# EAGLE schematic XT-009_Gold Standard (EAGLE 9.5.1)
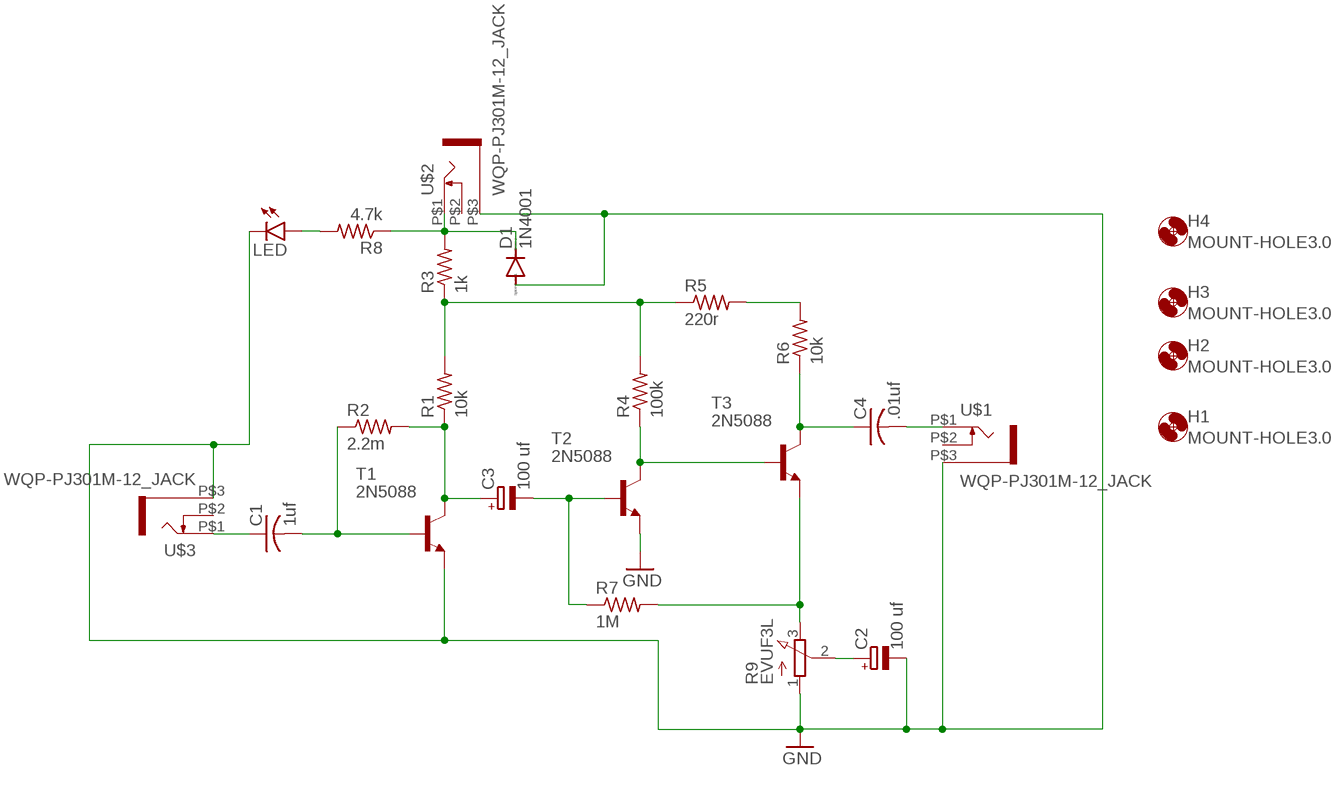
[diagram p0: schematic, sheet 1]

## Parts
C1  1uf  C-US050-025X075  [C050-025X075]
C2  100 uf  CPOL-EUE2.5-7  [E2,5-7]
C3  100 uf  CPOL-EUE2.5-7  [E2,5-7]
C4  .01uf  C-US050-025X075  [C050-025X075]
D1  1N4001  1N4004  [DO41-10]
H1  MOUNT-HOLE3.0  [3,0]
H2  MOUNT-HOLE3.0  [3,0]
H3  MOUNT-HOLE3.0  [3,0]
H4  MOUNT-HOLE3.0  [3,0]
LED  LED3MM  [LED3MM]
R1  10k  R-US_0207/7  [0207/7]
R2  2.2m  R-US_0207/7  [0207/7]
R3  1k  R-US_0207/7  [0207/7]
R4  100k  R-US_0207/7  [0207/7]
R5  220r  R-US_0207/7  [0207/7]
R6  10k  R-US_0207/7  [0207/7]
R7  1M  R-US_0207/7  [0207/7]
R8  4.7k  R-US_0207/7  [0207/7]
R9  EVUF3L  [EVUFXL]
T1  2N5088  [TO92]
T2  2N5088  [TO92]
T3  2N5088  [TO92]
U$1  WQP-PJ301M-12_JACK  [WQP-PJ301M-12_JACK]
U$2  WQP-PJ301M-12_JACK  [WQP-PJ301M-12_JACK]
U$3  WQP-PJ301M-12_JACK  [WQP-PJ301M-12_JACK]

## Nets
GND: C2.- D1.A LED.K(C) R9.1(A) T1.3(E) T2.3(E) U$1.P$3 U$2.P$3 U$3.P$3
N$1: C1.2 R2.1 T1.2(B)
N$2: C3.+ R1.1 R2.2 T1.1(C)
N$3: R1.2 R3.1 R4.2 R5.1
N$4: C1.1 U$3.P$1
N$5: LED.A R8.2
N$6: C3.- R7.1 T2.2(B)
N$7: R4.1 T2.1(C) T3.2(B)
N$8: R5.2 R6.2
N$9: C4.1 R6.1 T3.1(C)
N$10: C4.2 U$1.P$1
N$11: C2.+ R9.2(S)
N$12: D1.C R3.2 R8.1 U$2.P$1
N$13: R7.2 R9.3(E) T3.3(E)
Unconnected: U$1.P$2 U$2.P$2 U$3.P$2

## Library data of the parts
C1 C4 = rcl:C-US: CAPACITOR, American symbol; SPICEPREFIX: C
C2 C3 = rcl:CPOL-EU: POLARIZED CAPACITOR, European symbol; SPICEPREFIX: C
D1 = diode:1N4004: DIODE general purpose rectifier, 1 A
H1-H4 = holes:MOUNT-HOLE: MOUNTING HOLE with drill center marker
LED = led:LED: LED OSRAM: - CHIPLED LG R971, LG N971, LY N971, LG Q971, LY Q971, LO R971, LY R971 LH N974, LH R974 LS Q976, LO Q976, LY Q976 LO Q996 - Hyper CHIPLED LW Q18S LB Q993, LB Q99A, LB R99A - SideLED LS A670, LO A670, LY A670, LG A670, LP A670 LB A673, LV A673, LT A673, LW A673 LH A674 LY A675 LS A676, LA A676, LO A676, LY A676, LW A676 LS A679, LY A679, LG A679 - Hyper Micro SIDELED® LS Y876, LA Y876, LO Y876, LY Y876 LT Y87S - SmartLED LW L88C, LW L88S LB L89C, LB L89S, LG L890 LS L89K, LO L89K, LY L89K LS L896, LA L896, LO L896, LY L896 - TOPLED LS T670, LO T670, LY T670, LG T670, LP T670 LSG T670, LSP T670, LSY T670, LOP T670, LYG T670 LG T671, LOG T671, LSG T671 LB T673, LV T673, LT T673, LW T673 LH T674 LS T676, LA T676, LO T676, LY T676, LB T676, LH T676, LSB T676, LW T676 LB T67C, LV T67C, LT T67C, LS T67K, LO T67K, LY T67K, LW E67C LS E67B, LA E67B, LO E67B, LY E67B, LB E67C, LV E67C, LT E67C LW T67C LS T679, LY T679, LG T679 LS T770, LO T770, LY T770, LG T770, LP T770 LB T773, LV T773, LT T773, LW T773 LH T774 LS E675, LA E675, LY E675, LS T675 LS T776, LA T776, LO T776, LY T776, LB T776 LHGB T686 LT T68C, LB T68C - Hyper Mini TOPLED® LB M676 - Mini TOPLED Santana® LG M470 LS M47K, LO M47K, LY M47K Source: http://www.osram.convergy.de LUXEON: - LUMILED® LXK2-PW12-R00, LXK2-PW12-S00, LXK2-PW14-U00, LXK2-PW14-V00 LXK2-PM12-R00, LXK2-PM12-S00, LXK2-PM14-U00 LXK2-PE12-Q00, LXK2-PE12-R00, LXK2-PE12-S00, LXK2-PE14-T00, LXK2-PE14-U00 LXK2-PB12-K00, LXK2-PB12-L00, LXK2-PB12-M00, LXK2-PB14-N00, LXK2-PB14-P00, LXK2-PB14-Q00 LXK2-PR12-L00, LXK2-PR12-M00, LXK2-PR14-Q00, LXK2-PR14-R00 LXK2-PD12-Q00, LXK2-PD12-R00, LXK2-PD12-S00 LXK2-PH12-R00, LXK2-PH12-S00 LXK2-PL12-P00, LXK2-PL12-Q00, LXK2-PL12-R00 Source: www.luxeon.com KINGBRIGHT: KA-3528ASYC Source: www.kingbright.com
R1-R5 R8 = rcl:R-US_: RESISTOR, American symbol
R6 R7 = rcl:R-US_: RESISTOR, American symbol; SPICEPREFIX: R
R9 = pot:EVU: 9 mm Square Rotary Potentiometers Source: Panasonic
T1-T3 = transistor:2N5088: NPN TRANSISTOR
U$1-U$3 = thonkiconn:WQP-PJ301M-12_JACK